# Altium schematic sheet lessbadschematic.SchDoc
size A4; SheetNumber: 2; SheetTotal: 2
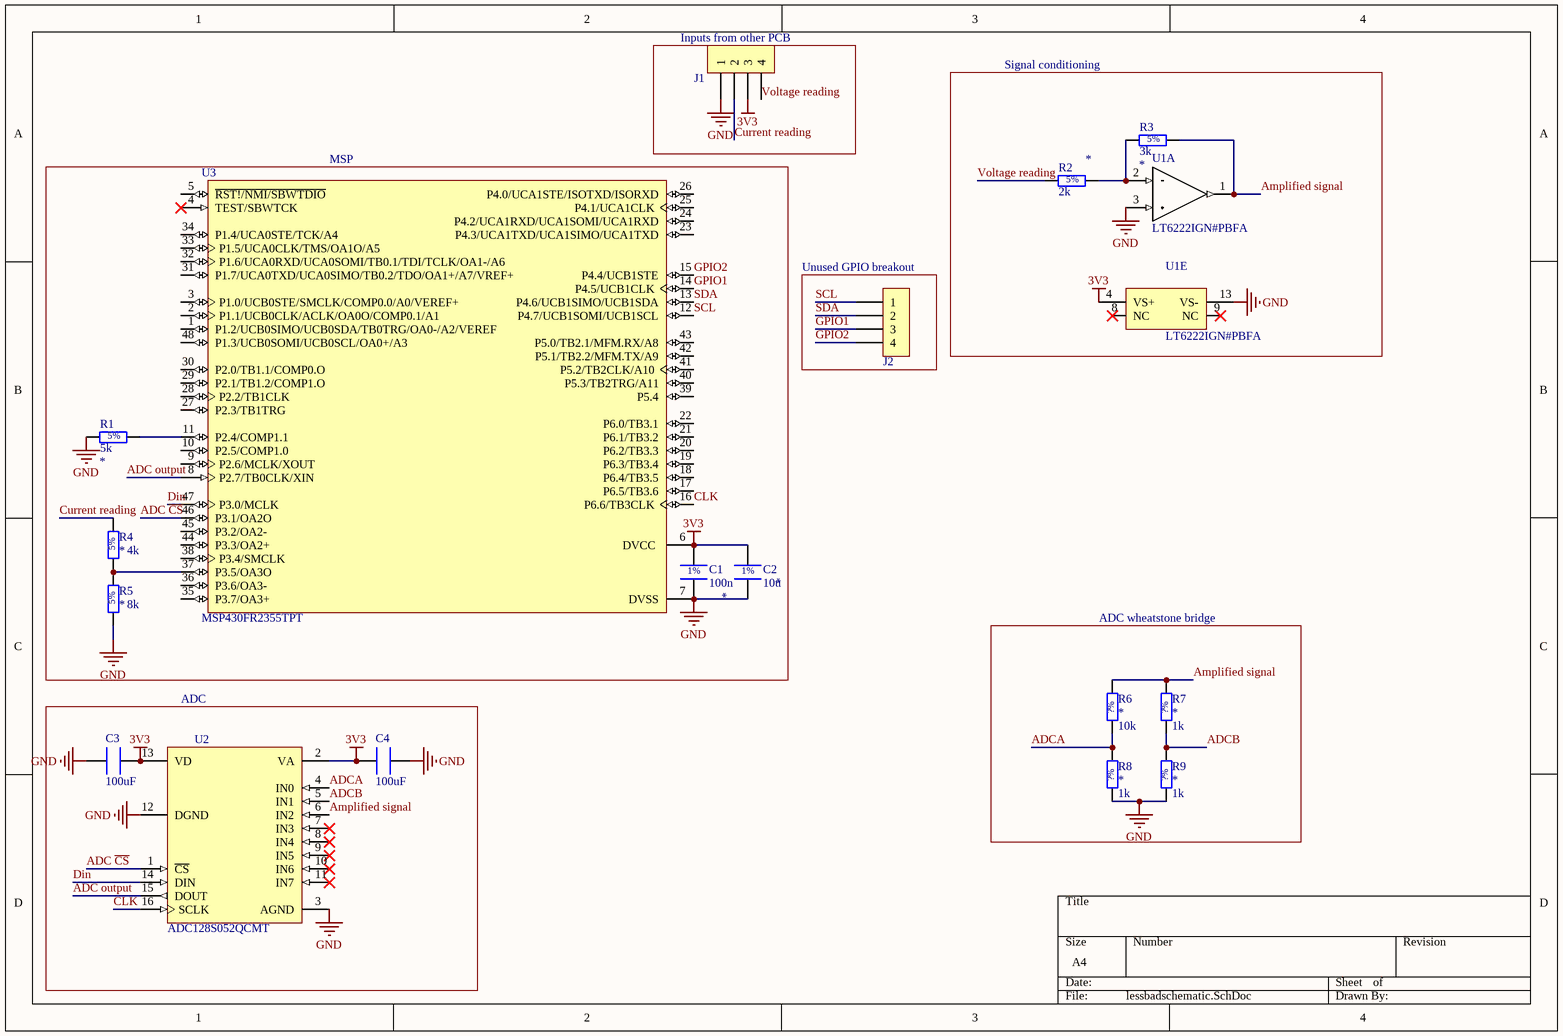
[diagram p0: lessbadschematic.SchDoc]

## Parts
C1  100n  [CAPACITOR_0402_1005M_55N]
C2  10u  [CAPACITOR_0402_1005M_55N]
C3  100uF  [CAPACITOR_0805_2012M-70N]
C4  100uF  [CAPACITOR_0805_2012M-70N]
J1  0530470410  [MOLEX_0530470410]  (value not drawn)
J2  0530470410  [MOLEX_0530470410]  (value not drawn)
R1  5k  [RESISTOR_0402_1005M_37N]
R2  2k  [RESISTOR_0402_1005M_37N]
R3  3k  [RESISTOR_0402_1005M_37N]
R4  MF Part No.: 4k  [Resistor_0805_2012M-50N]  (hidden comment: *)
R5  MF Part No.: 8k  [Resistor_0805_2012M-50N]  (hidden comment: *)
R6  MF Part No.: 10k  [RESISTOR_0805_2012M-50N]  (hidden comment: *)
R7  MF Part No.: 1k  [RESISTOR_0805_2012M-50N]  (hidden comment: *)
R8  MF Part No.: 1k  [RESISTOR_0805_2012M-50N]  (hidden comment: *)
R9  MF Part No.: 1k  [RESISTOR_0805_2012M-50N]  (hidden comment: *)
U1  LT6222IGN#PBFA  [SSOP-16N-3.9mmBody-1.75mm]  (parts A,E of 5)
U2  ADC128S052QCMT  [TSSOP-16N_4.4mmBody-1.2mm]
U3  MSP430FR2355TPT  [LQFP_PT_48_N]

## Blocks framed on the sheet
Inputs from other PCB: J1
Signal conditioning: R2 R3 U1
MSP: C1 C2 R1 R4 R5 U3
Unused GPIO breakout: J2
ADC wheatstone bridge: R6-R9
ADC: C3 C4 U2

## Nets
3V3: C1.2 C2.2 C3.2 C4.1 J1.3 U1.4(VS+) U2.2(VA) U2.13(VD) U3.6(DVCC)
GND: C1.1 C2.1 C3.1 C4.2 J1.1 R1.1 R5.1 R8.1 R9.1 U1.3(IN1+) U1.13(VS-) U2.3(AGND) U2.12(DGND) U3.7(DVSS)
ADC ~{CS}: U2.1(~{CS}) U3.46(P3.1/OA2O)
ADC output: U2.15(DOUT) U3.8(P2.7/TB0CLK/XIN)
ADCA: R6.1 R8.2 U2.4(IN0)
ADCB: R7.1 R9.2 U2.5(IN1)
Amplified signal: R3.2 R6.2 R7.2 U1.1(OUT1) U2.6(IN2)
CLK: U2.16(SCLK) U3.16(P6.6/TB3CLK)
Current reading: J1.2 R4.2
Din: U2.14(DIN) U3.47(P3.0/MCLK)
GPIO1: J2.3 U3.14(P4.5/UCB1CLK)
GPIO2: J2.4 U3.15(P4.4/UCB1STE)
SCL: J2.1 U3.12(P4.7/UCB1SOMI/UCB1SCL)
SDA: J2.2 U3.13(P4.6/UCB1SIMO/UCB1SDA)
Voltage reading: J1.4 R2.1
NetR1_2: R1.2 U3.11(P2.4/COMP1.1)
NetR2_2: R2.2 R3.1 U1.2(IN1-)
NetR4_1: R4.1 R5.2 U3.37(P3.5/OA3O)

Not connected (* = marked no-connect by the designer): U1 8(NC)* 9(NC)*; U2 7(IN3)* 8(IN4)* 9(IN5)* 10(IN6)* 11(IN7)*; U3 1(P1.2/UCB0SIMO/UCB0SDA/TB0TRG/OA0-/A2/VEREF) 2(P1.1/UCB0CLK/ACLK/OA0O/COMP0.1/A1) 3(P1.0/UCB0STE/SMCLK/COMP0.0/A0/VEREF+) 4(TEST/SBWTCK)* 5(~{RST!/NMI/SBWTDIO}) 9(P2.6/MCLK/XOUT) 10(P2.5/COMP1.0) 17(P6.5/TB3.6) 18(P6.4/TB3.5) 19(P6.3/TB3.4) 20(P6.2/TB3.3) 21(P6.1/TB3.2) 22(P6.0/TB3.1) 23(P4.3/UCA1TXD/UCA1SIMO/UCA1TXD) 24(P4.2/UCA1RXD/UCA1SOMI/UCA1RXD) 25(P4.1/UCA1CLK) 26(P4.0/UCA1STE/ISOTXD/ISORXD) 27(P2.3/TB1TRG) 28(P2.2/TB1CLK) 29(P2.1/TB1.2/COMP1.O) 30(P2.0/TB1.1/COMP0.O) 31(P1.7/UCA0TXD/UCA0SIMO/TB0.2/TDO/OA1+/A7/VREF+) 32(P1.6/UCA0RXD/UCA0SOMI/TB0.1/TDI/TCLK/OA1-/A6) 33(P1.5/UCA0CLK/TMS/OA1O/A5) 34(P1.4/UCA0STE/TCK/A4) 35(P3.7/OA3+) 36(P3.6/OA3-) 38(P3.4/SMCLK) 39(P5.4) 40(P5.3/TB2TRG/A11) 41(P5.2/TB2CLK/A10) 42(P5.1/TB2.2/MFM.TX/A9) 43(P5.0/TB2.1/MFM.RX/A8) 44(P3.3/OA2+) 45(P3.2/OA2-) 48(P1.3/UCB0SOMI/UCB0SCL/OA0+/A3)

## Notes on the sheet
- (in symbol GCM1555CxxxxxF Series) 1%

## Library data of the parts
C1 C2 = GCM1555CxxxxxF Series: Passive - Capacitor Series, 0402, C0G, 50V, ±1%, -55°C ~ 125°C, 0402 (1005 Metric); Capacitance at Rated Voltage: 100%; Value Range: 5pF ~ 1nF; E Series: E24; Tolerance: ±1%; Temperature Coefficient: C0G; Rated Voltage: 50V; Temp Range: -55°C ~ 125°C; Supplier 1: Digikey; Package: 0402; MF Part No.: *
  C1: Value: 100n
  C2: Value: 10u
C3 C4 = GRM21BR60J107ME15L: Passive - Capacitor, 0805, 100uF Max, X5R, 6.3V ±20%, -55°C ~ 85°C, 0805 (2012 Metric). 20uF @ 6.3V; Tolerance: ±20%; Temperature Coefficient: X5R; Capacitance at Rated Voltage: 20%; Rated Voltage: 6.3V; Temp Range: -55°C ~ 85°C; Package: 0805; Supplier 1: Digikey; Supplier 1 Part No.: 490-GRM155R61E225KE11JCT-ND; MF Part No.: GRM21BR60J107ME15L; Value: 100uF
J1 J2 = 0530470410: Header - Picoblade 04-pin, TH, STR; Pitch: 1.25mm; Mounting Type: Through-hole; Orientation: Straight; MF Part No.: 0530470410; Pins: 4; Supplier 1: Digikey; Supplier 1 Part No.: 530470410
R1-R3 = RMCF0402JT Series: Passive - Resistor Series, 0402, 5%, 1R - 20M, E24, 0.063W, 1/16W, ±100ppm/°C, -55°C ~ 155°C, 0402 (1005 Metric); Value Range: 1 ~ 20M; Rated Voltage: 50V; Tolerance: 5%; Power: 1/16W; E Series: E24; Temp Range: -55°C ~ 155°C; Supplier 1: Digikey; Package: 0402; Temperature Coefficient: ±100ppm/°C; MF Part No.: *
  R1: Value: 5k
  R2: Value: 2k
  R3: Value: 3k
R4 R5 = RMCF0805JT Series: Passive - Resistor Series, 0805, 5%, 100m - 22M, E24, 0.063W, 1/16W, ±200ppm/°C, -55°C ~ 155°C, 0805 (2012 Metric); Power: 1/8W; Value Range: 100m ~ 22M; Rated Voltage: 150V; Tolerance: 5%; E Series: E24; Temp Range: -55°C ~ 155°C; Supplier 1: Digikey; Package: 0805; Temperature Coefficient: ±200ppm/°C; Value: *
R6-R9 = Generic Resistor: Passive - Resistor, Generic; Tolerance: ?%; Value: *
U1 = LT6222IGN#PBF: IC - Opamp, High Speed, 4-Channel, 60MHz GBWP, RRIO, 2.2V to 12.6V, -40 to 85, SSOP-16; Temp Range: -40°C ~ 85°C; Package: TSSOP-16; MF Part No.: LT6222IGN#PBF; Rated Voltage: 12.6V; Supplier 1: Digikey; Supplier 1 Part No.: LT6222IGN#PBF-ND
U2 = ADC128S052QCMT: IC - ADC, 8-Channel, 12-bit, SPI, Split digital/analog Vcc; MF Part No.: ADC128S052QCMT/NOPB-ND; Temp Range: -40°C ~ 105°C; Rated Voltage: 5.25V; Footprint: TSSOP-16; Package: TSSOP-16; Supplier 1: Digikey; Supplier 1 Part No.: ADC128S052CIMT/NOPB-ND
U3 = MSP430FR2355TPT: IC - Microcontroller, 24MHz, 32KB FRAM, Op-Amps/PGAs, 12-bit DACs, 12-bit ADC, 48-LQFP, -40 to 105C; Temp Range: -40°C ~ 105°C; Rated Voltage: 3.6V; MF Part No.: MSP430FR2355TPT; Package: LQFP-48; Supplier 1: Digikey; Supplier 1 Part No.: 296-50260-ND